# EasyEDA Pro project Usb_Hub.epro

# Schematic Schematic1
Board Name: Board1; Create Date: 2026-05-26; Page Name: P1; Project Name: Usb_Hub; Schematic Name: Schematic1; Update Date: 2026-05-27; Company: EasyEDA.com; Page Size: A4; Version: V1.0
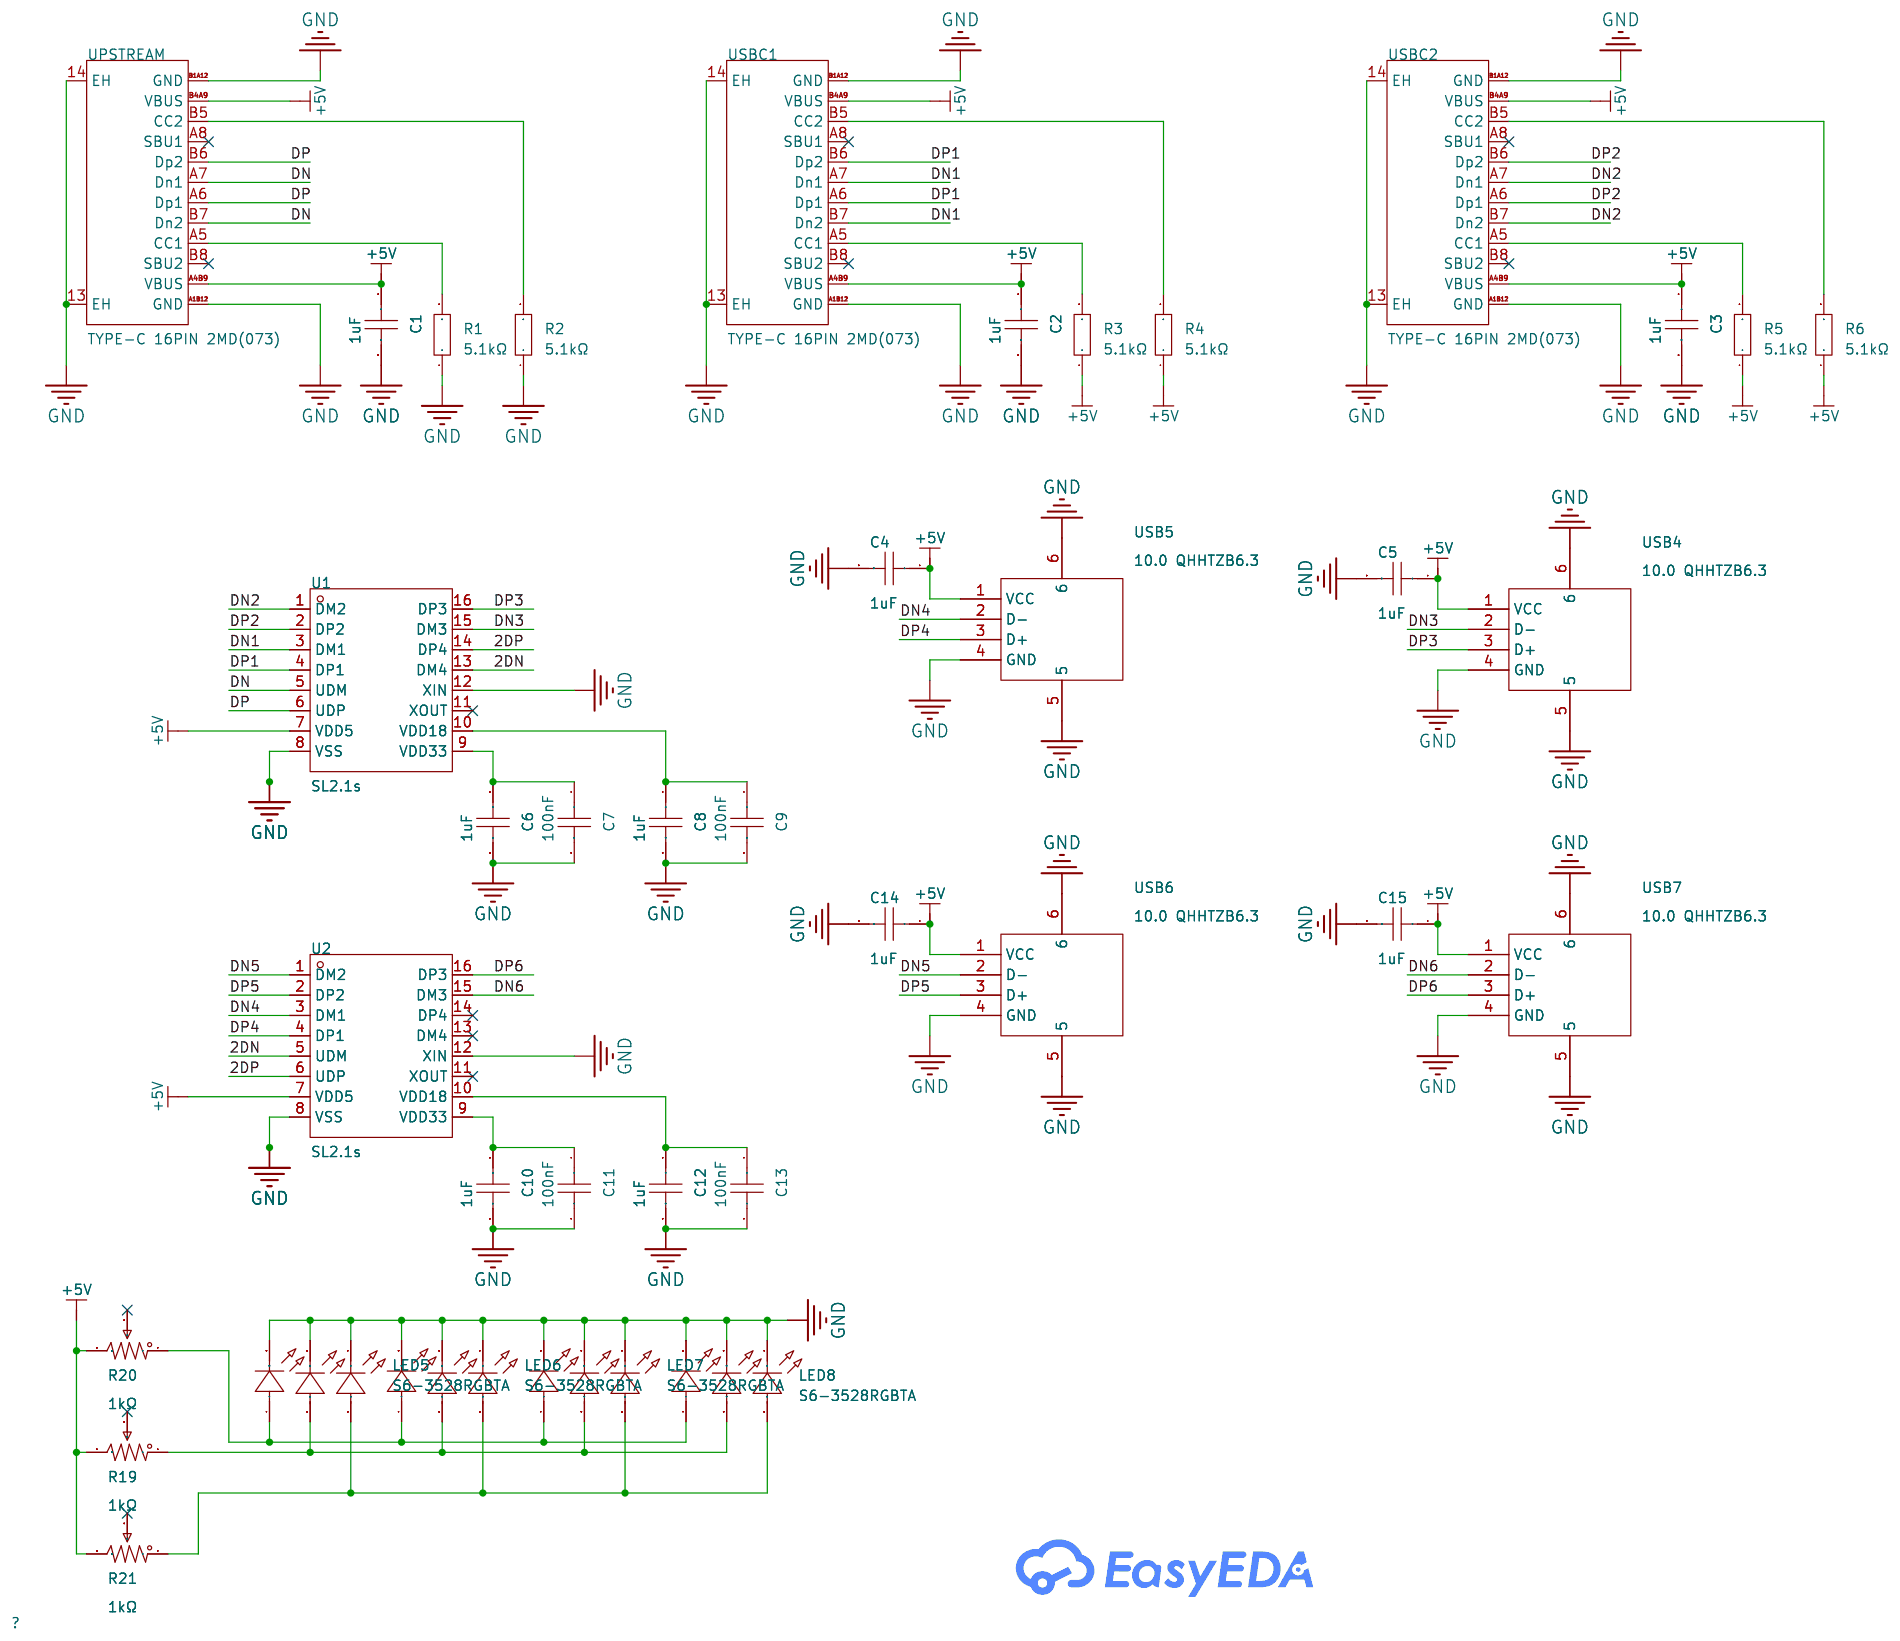
[diagram p0: schematic sheet]

## Parts
C1  1uF  [C0603]
C2  1uF  [C0603]
C3  1uF  [C0603]
C4  1uF  [C0603]
C5  1uF  [C0603]
C6  1uF  [C0603]
C7  100nF  [C0603]
C8  1uF  [C0603]
C9  100nF  [C0603]
C10  1uF  [C0603]
C11  100nF  [C0603]
C12  1uF  [C0603]
C13  100nF  [C0603]
C14  1uF  [C0603]
C15  1uF  [C0603]
LED5  S6-3528RGBTA  [LED-SMD-6P_S6-3528RGBTA]
LED6  S6-3528RGBTA  [LED-SMD-6P_S6-3528RGBTA]
LED7  S6-3528RGBTA  [LED-SMD-6P_S6-3528RGBTA]
LED8  S6-3528RGBTA  [LED-SMD-6P_S6-3528RGBTA]
R1  5.1kΩ  [R0603]
R2  5.1kΩ  [R0603]
R3  5.1kΩ  [R0603]
R4  5.1kΩ  [R0603]
R5  5.1kΩ  [R0603]
R6  5.1kΩ  [R0603]
R19  1kΩ  [RES-ADJ-SMD_3P-L3.8-W3.6-P1.90-BL]
R20  1kΩ  [RES-ADJ-SMD_3P-L3.8-W3.6-P1.90-BL]
R21  1kΩ  [RES-ADJ-SMD_3P-L3.8-W3.6-P1.90-BL]
U1  SL2.1s  [SSOP-16_L4.6-W2.6-P0.53-LS4.0-BL]
U2  SL2.1s  [SSOP-16_L4.6-W2.6-P0.53-LS4.0-BL]
UPSTREAM  TYPE-C 16PIN 2MD(073)  [USB-C-SMD_TYPE-C-16PIN-2MD-073]
USB4  10.0 QHHTZB6.3  [USB-A-TH_10.0QHHTZB6.3]
USB5  10.0 QHHTZB6.3  [USB-A-TH_10.0QHHTZB6.3]
USB6  10.0 QHHTZB6.3  [USB-A-TH_10.0QHHTZB6.3]
USB7  10.0 QHHTZB6.3  [USB-A-TH_10.0QHHTZB6.3]
USBC1  TYPE-C 16PIN 2MD(073)  [USB-C-SMD_TYPE-C-16PIN-2MD-073]
USBC2  TYPE-C 16PIN 2MD(073)  [USB-C-SMD_TYPE-C-16PIN-2MD-073]

## Library data of the parts
C1-C6 C8 C10 C12 C14 C15 = CL10A105KB8NNNC: Capacitance:1uF Tolerance:±10% Tolerance:±10% Voltage Rating:50V Temperature Coefficient:X5R; LCSC Part Name: 1uF ±10% 50V; Supplier Part: C15849; Manufacturer: SAMSUNG(三星); Supplier Footprint: 0603; JLCPCB Part Class: Basic Part; Datasheet: https://item.szlcsc.com/datasheet/CL10A105KB8NNNC/16531.html; Supplier: LCSC; Tolerance: ±10%; Voltage Rating: 50V; Temperature Coefficient: X5R
C7 C9 C11 C13 = C0603X104K050T: Capacitance: Tolerance:±10% Tolerance:±10% Voltage Rated: Temperature Coefficient:; LCSC Part Name: 100nF ±10% 50V; Supplier Part: C187860; Manufacturer: IHHEC(禾伸堂); Supplier Footprint: 0603; JLCPCB Part Class: Extended Part; Datasheet: https://atta.szlcsc.com/upload/public/pdf/source/20180316/B1A881EE882D7AA2911761F448C7BFE2.pdf; Supplier: LCSC; Tolerance: ±10%
LED5-LED8 = S6-3528RGBTA: Viewing Angle:120° Lens Color:Water Clear Operating Temperature:-40℃~+85℃ Operating Temperature:-40℃~+85℃; LCSC Part Name: RGB三色; Supplier Part: C2843672; Manufacturer: TUOZHAN(拓展光电); Supplier Footprint: SMD3528-6P; JLCPCB Part Class: Extended Part; Datasheet: https://item.szlcsc.com/datasheet/S6-3528RGBTA/3032464.html; Supplier: LCSC; Viewing Angle: 120°; Lens Color: Water Clear; Operating Temperature: -40℃~+85℃
R1-R6 = 0603WAF5101T5E: Type:Thick Film Resistor Resistance:5.1kΩ Tolerance:±1% Tolerance:±1% Power(Watts):100mW Voltage-Supply(Max):75V Temperature Coefficient:±100ppm/℃ Temperature Coefficient:±100ppm/℃ Operating Temperature:-55℃~+155℃ Operating Temperature:-55℃~+155℃; LCSC Part Name: 5.1kΩ ±1% 100mW 厚膜电阻; Supplier Part: C23186; Manufacturer: UNI-ROYAL(厚声); Supplier Footprint: 0603; JLCPCB Part Class: Basic Part; Datasheet: https://item.szlcsc.com/datasheet/0603WAF5101T5E/23913.html; Supplier: LCSC; Type: Thick Film Resistor; Tolerance: ±1%; Power(Watts): 100mW; Voltage-Supply(Max): 75V; Temperature Coefficient: ±100ppm/℃; Operating Temperature: -55℃~+155℃
R19-R21 = TC33X-2-102E: Resistance:1kΩ Tolerance:±25% Tolerance:±25% Voltage Rating:- Power(Watts):150mW Temperature Coefficient:±250ppm/℃ Temperature Coefficient:±250ppm/℃ Number of Turns:; LCSC Part Name: 1kΩ ±25%; Supplier Part: C719174; Manufacturer: BOURNS; Supplier Footprint: SMD-3P,3.8x3.6mm; JLCPCB Part Class: Extended Part; Datasheet: https://item.szlcsc.com/datasheet/TC33X-2-102E/762156.html; Supplier: LCSC; Tolerance: ±25%; Power(Watts): 150mW; Temperature Coefficient: ±250ppm/℃
U1 U2 = SL2.1s: type:Hub USB Protocol:USB 2.0 Data Rate:- Voltage - Supply:4V~5.25V Voltage - Supply:4V~5.25V Operating Temperature:0℃~+70℃ Operating Temperature:0℃~+70℃ Memory Interface:- Current - Supply:120mA Quiescent Supply Current:2.5mA Number of Channels:4; LCSC Part Name: USB2.0 HUB控制器集成电路; Supplier Part: C2684433; Manufacturer: CoreChips(和芯润德); Supplier Footprint: SSOP-16; JLCPCB Part Class: Extended Part; Datasheet: https://item.szlcsc.com/datasheet/SL2.1s/2782346.html; Supplier: LCSC; type: Hub; USB Protocol: USB 2.0; Voltage - Supply: 4V~5.25V; Operating Temperature: 0℃~+70℃; Current - Supply: 120mA; Quiescent Supply Current: 2.5mA; Number of Channels: 4
UPSTREAM USBC1 USBC2 = TYPE-C 16PIN 2MD(073): Connector Type:Type-C Protocol Standard:- Gender:Female Mounting Type:Surface Mount, Right Angle Number of Contacts:16P Number of Ports:1 Current Rating-Power:3A Voltage Rating:5V Connect-Disconnect Life:10,000 Cycles Supplementary Features:- Center Heigh; LCSC Part Name: Type-C 母 卧贴; Supplier Part: C2765186; Manufacturer: SHOU HAN(首韩); Supplier Footprint: SMD; JLCPCB Part Class: Extended Part; Datasheet: https://item.szlcsc.com/datasheet/TYPE-C%252016PIN%25202MD(073)/2901843.html; Supplier: LCSC; Connector Type: Type-C; Gender: Female; Mounting Type: Surface Mount, Right Angle; Number of Contacts: 16P; Number of Ports: 1; Current Rating-Power: 3A; Voltage Rating: 5V; Connect-Disconnect Life: 10,000 Cycles; Detection color: Black; Operating Temperature: -25℃~+85℃
USB4-USB7 = 10.0 QHHTZB6.3: Connector Type:Type-A Protocol Standard:USB 2.0 Gender:Female Mounting Type:Surface Mount, Right Angle Number of Contacts:4P Number of Ports:1 Current Rating-Power:1.5A Voltage Rating:30V Connect-Disconnect Life:5,000 times Supplementary Features:- Center; LCSC Part Name: 壳长10.0mm; Supplier Part: C668591; Manufacturer: SHOU HAN(首韩); Supplier Footprint: SMD; JLCPCB Part Class: Extended Part; Datasheet: https://item.szlcsc.com/datasheet/10.0%2520QHHTZB6.3/698534.html; Supplier: LCSC; Connector Type: Type-A; Protocol Standard: USB 2.0; Gender: Female; Mounting Type: Surface Mount, Right Angle; Number of Contacts: 4P; Number of Ports: 1; Current Rating-Power: 1.5A; Voltage Rating: 30V; Connect-Disconnect Life: 5,000 times; Length: 10mm; Detection color: Black; Operating Temperature: -25℃~+85℃

## Nets
+5V: C1.1 C2.1 C3.1 C4.1 C5.1 C14.1 C15.1 R3.1 R4.1 R5.1 R6.1 R19.3 R20.3 R21.3 U1.7(VDD5) U2.7(VDD5) UPSTREAM.A4B9(VBUS) UPSTREAM.B4A9(VBUS) USB4.1(VCC) USB5.1(VCC) USB6.1(VCC) USB7.1(VCC) USBC1.A4B9(VBUS) USBC1.B4A9(VBUS) USBC2.A4B9(VBUS) USBC2.B4A9(VBUS)
GND: C1.2 C2.2 C3.2 C4.2 C5.2 C6.2 C7.2 C8.2 C9.2 C10.2 C11.2 C12.2 C13.2 C14.2 C15.2 LED5.1 LED5.2 LED5.3 LED6.1 LED6.2 LED6.3 LED7.1 LED7.2 LED7.3 LED8.1 LED8.2 LED8.3 R1.1 R2.1 U1.8(VSS) U1.12(XIN) U2.8(VSS) U2.12(XIN) UPSTREAM.13(EH) UPSTREAM.14(EH) UPSTREAM.A1B12(GND) UPSTREAM.B1A12(GND) USB4.4(GND) USB4.5 USB4.6 USB5.4(GND) USB5.5 USB5.6 USB6.4(GND) USB6.5 USB6.6 USB7.4(GND) USB7.5 USB7.6 USBC1.13(EH) USBC1.14(EH) USBC1.A1B12(GND) USBC1.B1A12(GND) USBC2.13(EH) USBC2.14(EH) USBC2.A1B12(GND) USBC2.B1A12(GND)
2DN: U1.13(DM4) U2.5(UDM)
2DP: U1.14(DP4) U2.6(UDP)
DN: U1.5(UDM) UPSTREAM.A7(Dn1) UPSTREAM.B7(Dn2)
DN1: U1.3(DM1) USBC1.A7(Dn1) USBC1.B7(Dn2)
DN2: U1.1(DM2) USBC2.A7(Dn1) USBC2.B7(Dn2)
DN3: U1.15(DM3) USB4.2(D-)
DN4: U2.3(DM1) USB5.2(D-)
DN5: U2.1(DM2) USB6.2(D-)
DN6: U2.15(DM3) USB7.2(D-)
DP: U1.6(UDP) UPSTREAM.A6(Dp1) UPSTREAM.B6(Dp2)
DP1: U1.4(DP1) USBC1.A6(Dp1) USBC1.B6(Dp2)
DP2: U1.2(DP2) USBC2.A6(Dp1) USBC2.B6(Dp2)
DP3: U1.16(DP3) USB4.3(D+)
DP4: U2.4(DP1) USB5.3(D+)
DP5: U2.2(DP2) USB6.3(D+)
DP6: U2.16(DP3) USB7.3(D+)
$1N1306: R1.2 UPSTREAM.A5(CC1)
$1N1314: R2.2 UPSTREAM.B5(CC2)
$1N1689: R4.2 USBC1.B5(CC2)
$1N1692: R3.2 USBC1.A5(CC1)
$1N1910: R6.2 USBC2.B5(CC2)
$1N1913: R5.2 USBC2.A5(CC1)
$1N2720: C6.1 C7.1 U1.9(VDD33)
$1N2798: C8.1 C9.1 U1.10(VDD18)
$1N3096: C10.1 C11.1 U2.9(VDD33)
$1N3102: C12.1 C13.1 U2.10(VDD18)
$1N5396: LED5.5 LED6.5 LED7.5 LED8.5 R19.1
$1N5400: LED5.4 LED6.4 LED7.4 LED8.4 R20.1
$1N5407: LED5.6 LED6.6 LED7.6 LED8.6 R21.1

Not connected (* = marked no-connect by the designer): R19 2*; R20 2*; R21 2*; U1 11(XOUT)*; U2 11(XOUT)* 13(DM4)* 14(DP4)*; UPSTREAM A8(SBU1)* B8(SBU2)*; USBC1 A8(SBU1)* B8(SBU2)*; USBC2 A8(SBU1)* B8(SBU2)*

# Board PCB1
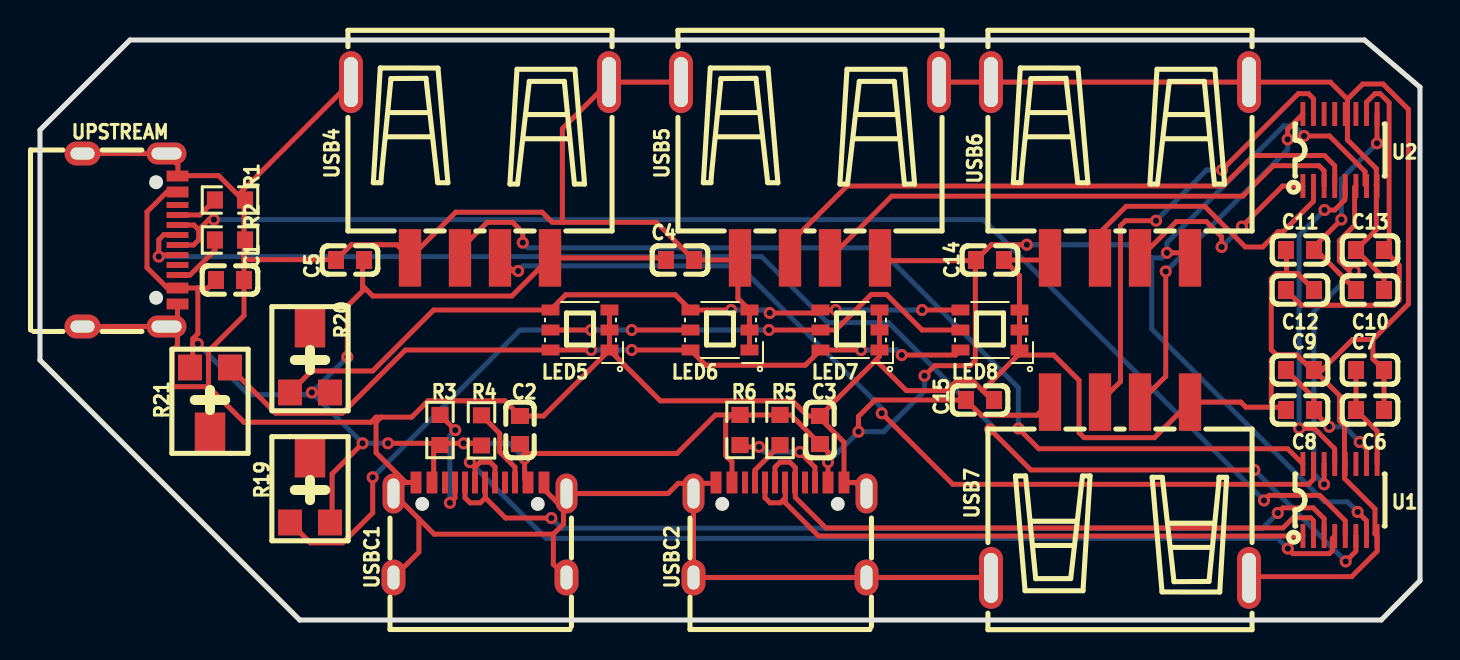
[diagram p1: board, top side]
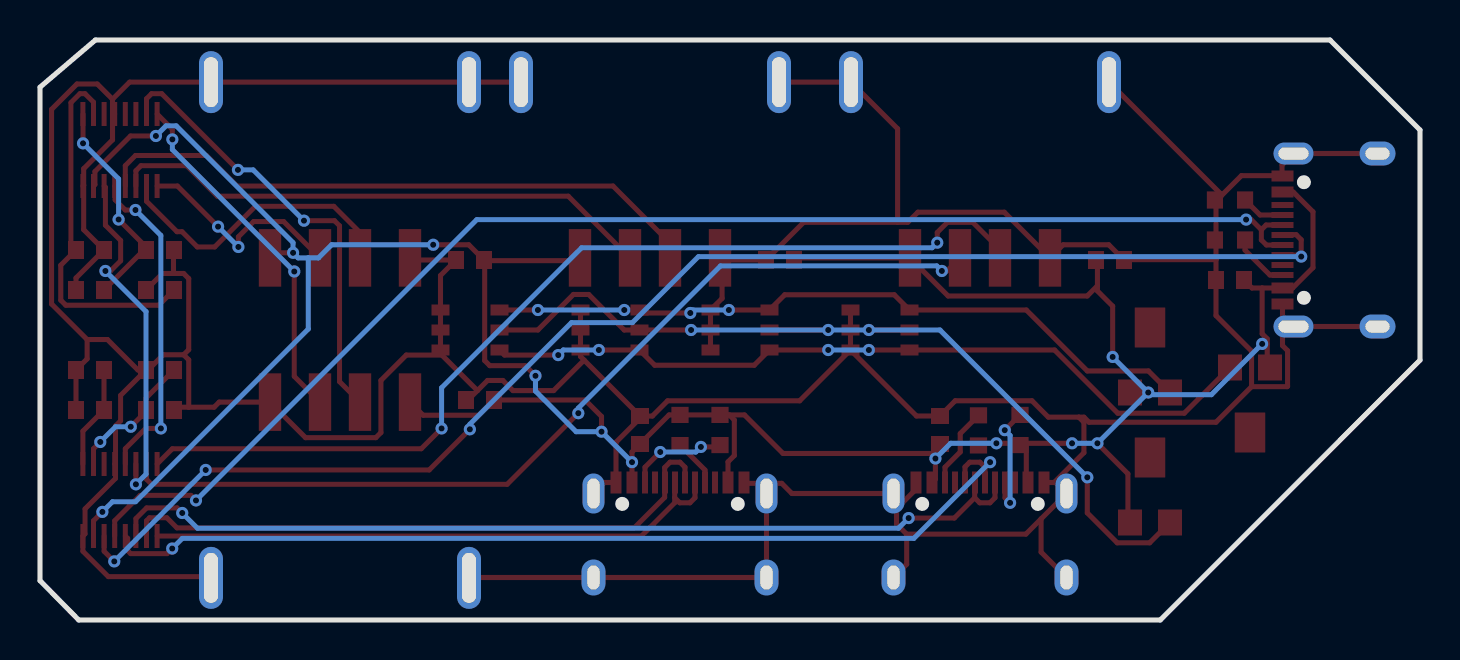
[diagram p2: board, bottom side, seen from below]

Outline 69 x 29 mm; copper layers: Top Layer, Bottom Layer. Coordinates in mm from the lower left corner of the outline.
Outline path: 0,24.5 0,12.99 12.98,0 67.06,0 69,1.97 69,26.64 66.23,29 4.5,29 0,24.5
Stack: Top Layer 0.035mm / Dielectric1 1.51mm FR4 er 4.5 / Bottom Layer 0.035mm

## Design rules (mm)
template: JLCPCB Capability(Two Layers Board)
spacing copperThickness1oz (default): track to track 0.102, other pairs 0.152 to 0.3
spacing copperThickness2oz: track to track 0.203, other pairs 0.152 to 0.3
track width copperThickness1oz (default): min 0.127, default 0.254, max 2.54
track width copperThickness2oz: min 0.203, default 0.254, max 2.54
differential pair differentialPair (default): width min 0.127, default 0.254, max 2.54; gap min 0.152, default 0.152
via viaSize (default): diameter min 0.5, default 0.61, max 10; hole min 0.3, default 0.305, max 6.3

## Placement (name value [footprint] x y rotation side)
C1  1uF  [C0603]  9.5 17 0 top
C2  1uF  [C0603]  24 9.5 90 top
C3  1uF  [C0603]  39 9.5 90 top
C4  1uF  [C0603]  32 18 0 top
C5  1uF  [C0603]  15.5 18 180 top
C6  1uF  [C0603]  66.5 10.5 0 top
C7  100nF  [C0603]  66.5 12.5 0 top
C8  1uF  [C0603]  63 10.5 180 top
C9  100nF  [C0603]  63 12.5 0 top
C10  1uF  [C0603]  66.5 16.5 0 top
C11  100nF  [C0603]  63 18.5 180 top
C12  1uF  [C0603]  63 16.5 0 top
C13  100nF  [C0603]  66.5 18.5 180 top
C14  1uF  [C0603]  47.5 18 0 top
C15  1uF  [C0603]  47 11 0 top
LED5  S6-3528RGBTA  [LED-SMD-6P_S6-3528RGBTA]  27 14.5 90 top
LED6  S6-3528RGBTA  [LED-SMD-6P_S6-3528RGBTA]  34 14.5 90 top
LED7  S6-3528RGBTA  [LED-SMD-6P_S6-3528RGBTA]  40.5 14.5 90 top
LED8  S6-3528RGBTA  [LED-SMD-6P_S6-3528RGBTA]  47.5 14.5 90 top
R1  5.1kΩ  [R0603]  9.5 21 180 top
R2  5.1kΩ  [R0603]  9.5 19 180 top
R3  5.1kΩ  [R0603]  20 9.5 90 top
R4  5.1kΩ  [R0603]  22.08 9.48 90 top
R5  5.1kΩ  [R0603]  37 9.5 270 top
R6  5.1kΩ  [R0603]  35 9.5 270 top
R19  1kΩ  [RES-ADJ-SMD_3P-L3.8-W3.6-P1.90-BL]  13.5 6.5 270 top
R20  1kΩ  [RES-ADJ-SMD_3P-L3.8-W3.6-P1.90-BL]  13.5 13 270 top
R21  1kΩ  [RES-ADJ-SMD_3P-L3.8-W3.6-P1.90-BL]  8.5 11 90 top
U1  SL2.1s  [SSOP-16_L4.6-W2.6-P0.53-LS4.0-BL]  65 6 0 top
U2  SL2.1s  [SSOP-16_L4.6-W2.6-P0.53-LS4.0-BL]  65 23.5 0 top
UPSTREAM  TYPE-C 16PIN 2MD(073)  [USB-C-SMD_TYPE-C-16PIN-2MD-073]  4.5 19 270 top
USB4  10.0 QHHTZB6.3  [USB-A-TH_10.0QHHTZB6.3]  22 22.5 180 top
USB5  10.0 QHHTZB6.3  [USB-A-TH_10.0QHHTZB6.3]  38.5 22.5 180 top
USB6  10.0 QHHTZB6.3  [USB-A-TH_10.0QHHTZB6.3]  54 22.5 180 top
USB7  10.0 QHHTZB6.3  [USB-A-TH_10.0QHHTZB6.3]  54 6.5 0 top
USBC1  TYPE-C 16PIN 2MD(073)  [USB-C-SMD_TYPE-C-16PIN-2MD-073]  22 4.5 0 top
USBC2  TYPE-C 16PIN 2MD(073)  [USB-C-SMD_TYPE-C-16PIN-2MD-073]  37 4.5 0 top

## Footprints (pads in the part's own frame, mm; a bottom-side part is the same pattern mirrored in y, then rotated)
C0603
  rect 0.8x0.9 smd: 1(-0.7,0) 2(0.7,0)
LED-SMD-6P_S6-3528RGBTA
  rect 0.55x0.9 smd: 1(-1,-1.475) 2(0,-1.475) 3(1,-1.475) 4(1,1.475) 5(0,1.475) 6(-1,1.475)
R0603
  rect 0.806x0.864 smd: 1(-0.753,0) 2(0.753,0)
RES-ADJ-SMD_3P-L3.8-W3.6-P1.90-BL
  rect 1.3x1.2 smd: 1(1.625,-1) 3(1.625,1)
  rect 2x1.524 smd: 2(-1.625,0)
SSOP-16_L4.6-W2.6-P0.53-LS4.0-BL
  rect 0.25x1.2 smd: 1(-1.855,-1.8) 2(-1.325,-1.8) 3(-0.795,-1.8) 4(-0.265,-1.8) 5(0.265,-1.8) 6(0.795,-1.8) 7(1.325,-1.8) 8(1.855,-1.8) 9(1.855,1.8) 10(1.325,1.8) 11(0.795,1.8) 12(0.265,1.8) 13(-0.265,1.8) 14(-0.795,1.8) 15(-1.325,1.8) 16(-1.855,1.8)
USB-A-TH_10.0QHHTZB6.3
  rect 1.12x2.88 smd: 1(-3.5,4.395) 2(-1,4.395) 3(1,4.395) 4(3.5,4.395)
  oval 1.2x3.1 hole 0.7x2.5: 5(-6.45,-4.395) 6(6.45,-4.395)
USB-C-SMD_TYPE-C-16PIN-2MD-073
  oval 1.1x2 hole 0.6x1.5: 13(-4.325,1.825) 14(4.325,1.825)
  oval 1.2x1.8 hole 0.6x1.2: 13(-4.325,-2.375) 14(4.325,-2.375)
  rect 0.55x1.1 smd: A1B12(-3.2,2.375) A4B9(-2.4,2.375) B1A12(3.2,2.375) B4A9(2.4,2.375)
  rect 0.3x1.1 smd: A5(-1.25,2.375) A6(-0.25,2.375) A7(0.25,2.375) A8(1.25,2.375) B5(1.75,2.375) B6(0.75,2.375) B7(-0.75,2.375) B8(-1.75,2.375)

## Nets
As in the schematic.

Pads without a net: R19 2; R20 2; R21 2; U1 11; U2 11 13 14; UPSTREAM A8 B8; USBC1 A8 B8; USBC2 A8 B8

## Via types
v1: diameter 0.61, hole 0.305, Top Layer to Bottom Layer, 58 vias

## Routing (per net, layer and track width the routed paths; a pad name or vN(x,y) marks a point on that pad's centre or on a via; arc(x,y) is an arc through that point)
+5V: length 164.6
  Top Layer w0.25: v1(65.88,5.41) 66.32,4.96 U1.7 ; v1(63.21,24.2) 64.47,24.2 66.25,22.42 66.25,21.77 U2.7
  Top Layer w0.254: 19.69,8.83 19.91,8.83 ; 19.69,8.83 19.69,6.96 USBC1.A4B9 ; 19.69,8.83 v1(17.4,8.83) ; 19.91,8.83 R3.1 ; 19.91,8.83 v1(21.18,8.83) 21.97,8.83 R4.1 ; 46.77,17.97 42.14,17.97 USB5.1 ; 46.77,17.97 C14.1 47.56,18.76 v1(49.34,18.76) ; 46.77,17.97 46.77,12.97 46.51,12.72 44.73,12.72 v1(44.23,12.21) ; UPSTREAM.A4B9 6.34,21.4 5.35,20.41 5.35,17.62 6.37,16.6 UPSTREAM.B4A9 7.89,16.6 ; 24.23,8.33 31.85,8.33 33.78,10.25 34.54,10.25 ; 24.23,8.33 v1(24.23,8.07) 24.23,7.05 USBC1.B4A9 ; 24.23,8.33 24.23,8.57 C2.1 ; 7.64,13.81 7.64,14.06 7.89,14.31 7.89,16.6 ; 7.64,13.81 v1(7.89,13.81) ; 7.64,13.81 7.64,12.76 R21.3 ; USBC2.A4B9 34.6,7.91 34.28,8.22 34.28,10 34.54,10.25 ; v1(13.59,11.38) R20.3 ; 34.54,10.25 R6.1 R5.1 37.55,10.25 C3.1 39.4,8.4 v1(39.4,7.89) USBC2.B4A9 ; 7.89,16.6 8.4,16.6 C1.1 ; 16.13,16.71 16.13,16.45 15.37,15.69 v1(15.37,13.15) ; 16.13,16.71 16.64,16.2 23.6,16.2 USB4.1 31.19,18.11 C4.1 ; 16.13,16.71 16.13,17.93 C5.1 ; v1(40.92,9.42) 40.92,10.18 41.75,11 C15.1 47.06,10.24 49.84,10.24 USB7.1 ; USB6.1 57.25,18.36 v1(56.35,18.36) ; R19.3 14.61,4.98 14.61,7.31 v1(16.13,8.83)
  Bottom Layer w0.25: v1(63.21,24.2) 62.7,24.71 62.19,24.71 56.35,18.87 v1(56.35,18.36) ; v1(65.88,5.41) 65.37,5.91 64.22,5.91 55.59,14.55 55.59,18.11
  Bottom Layer w0.254: v1(17.4,8.83) v1(16.13,8.83) v1(13.59,11.38) ; v1(56.35,18.36) 56.09,18.11 55.08,18.11 54.42,18.76 v1(49.34,18.76) ; v1(39.4,7.89) v1(40.92,9.42) 42.19,9.42 44.23,11.45 v1(44.23,12.21) ; v1(13.59,11.38) 13.48,11.27 10.43,11.27 v1(7.89,13.81) ; v1(13.59,11.38) v1(15.37,13.15) ; v1(21.18,8.83) 23.47,8.83 v1(24.23,8.07)
GND: length 302.1
  Top Layer w0.25: 65.37,25.28 U2.12 ; 65.37,26.04 64.52,26.89 USB6.5 ; 65.22,7.84 65.22,7.08 66.75,5.56 66.75,4.31 U1.8 66.85,3.44 65.59,2.17 60.51,2.17 USB7.6 ; 65.22,7.84 65.22,9.71 64.97,9.96 64.97,11.23 C9.2 ; 65.22,7.84 U1.12 ; 66.82,21.74 U2.8
  Top Layer w0.254: USB5.5 USB6.6 USB6.5 ; 61.82,13.26 62.83,13.26 63.6,12.5 C9.2 64.1,12.5 65.63,14.02 66.64,14.02 ; 61.82,13.26 61.56,13.01 61.56,10.64 ; 61.82,13.26 61.56,13.52 61.56,17.07 61.82,17.33 62.33,17.33 ; LED5.1 31.01,10.96 37.62,10.96 38.38,10.2 38.89,10.2 ; LED5.1 25.18,10.2 C2.2 23.24,10.96 19.4,10.96 18.58,10.14 17.06,10.14 ; LED5.1 LED5.2 LED5.3 ; USBC1.13 18.94,3.39 18.94,5.06 ; 25.92,5.82 25.92,5.92 USBC1.14 31.41,6.33 31.91,6.83 32.68,6.83 ; 25.92,5.82 26.17,5.56 26.17,4.8 25.67,4.29 ; 25.92,5.82 25.2,6.54 USBC1.B1A12 ; 62.33,17.33 62.33,18.47 C11.2 ; 62.33,17.33 62.87,17.33 C12.2 ; 47.13,11.47 46.62,11.98 45.86,11.98 45.35,11.47 43.32,11.47 41.79,12.99 ; 47.13,11.47 47.6,11 C15.2 ; 47.13,11.47 48.91,13.25 ; 8.42,11.67 8.42,13.44 10.2,15.22 C1.2 10.2,18.02 ; 8.42,11.67 6.64,11.67 6.62,11.69 6.62,13.47 6.88,13.72 6.88,14.74 ; 8.42,11.67 10.2,9.89 16.55,9.89 16.8,10.14 17.06,10.14 ; 18.29,6.88 USBC1.A1B12 ; 18.29,6.88 16.8,8.36 16.8,9.89 17.06,10.14 ; 18.29,6.88 18.22,6.88 USBC1.13 18.94,5.06 ; 61.56,10.64 62.16,10.64 C8.2 ; 61.56,10.64 60.29,10.64 60.04,10.89 USB7.4 55.72,9.12 52.21,9.12 51.95,9.37 51.95,11.98 50.68,13.25 48.91,13.25 ; 48.91,13.25 48.91,13.43 LED8.1 LED8.2 LED8.3 48.97,17.22 C14.2 50.4,18 USB6.4 ; 6.88,14.74 UPSTREAM.B1A12 ; 6.88,14.74 6.39,14.74 UPSTREAM.14 UPSTREAM.14 ; 10.2,18.02 14.78,18.02 C5.2 15.56,18.76 17.84,18.76 USB4.4 20.79,20.39 25.1,20.39 25.61,19.88 26.12,19.88 ; 10.2,18.02 10.2,18.95 ; 10.2,18.95 R2.1 ; 10.2,18.95 10.2,20.95 ; 18.94,5.06 19.71,4.29 25.67,4.29 ; USBC2.A1B12 33.76,6.83 32.68,6.83 ; 6.9,22.22 8.93,22.22 9.95,21.2 ; 6.9,22.22 UPSTREAM.A1B12 ; 6.9,22.22 6.9,22.75 UPSTREAM.13 UPSTREAM.13 ; 66.64,14.02 66.64,13.06 C7.2 C6.2 ; 66.64,14.02 68.42,15.8 68.42,25.53 67.15,26.8 66.14,26.8 65.37,26.04 65.37,24.01 66.82,22.56 66.82,19.52 C13.2 67.2,17.1 C10.2 ; USBC1.14 25.67,2.78 25.67,4.29 ; 10.2,20.95 R1.1 ; 10.2,20.95 9.95,21.2 ; 38.89,10.2 C3.2 41.79,12.99 ; 38.89,10.2 40.2,8.89 USBC2.B1A12 40.78,6.88 USBC2.14 ; USB5.6 USB4.5 26.12,24.56 26.12,19.88 ; 32.68,6.83 USBC2.13 USBC2.13 USBC2.14 47.53,2.12 USB7.5 ; 41.79,12.99 41.97,13.17 LED7.1 LED7.2 LED7.3 ; LED6.1 LED6.2 LED6.3 34.9,16.08 34.9,18 ; USB4.6 9.95,21.29 9.95,21.2 ; 26.12,19.88 30.82,19.88 C4.2 34.9,18 ; 34.9,18 USB5.4
2DN: length 16.3
  Top Layer w0.25: U2.5 65.24,21.68 65.24,21.01 64.74,20.5 v1(64.23,20.5) ; U1.13 64.74,8.56 63.72,9.58 v1(62.96,9.58)
  Bottom Layer w0.25: v1(62.96,9.58) 62.96,19.23 v1(64.23,20.5)
2DP: length 17.8
  Top Layer w0.25: v1(65.73,17.45) 65.47,17.45 64.97,17.96 64.97,18.98 65.73,19.74 65.73,21.63 U2.6 ; U1.14 v1(64.21,6.78)
  Bottom Layer w0.25: v1(65.73,17.45) 63.7,15.42 63.7,7.29 v1(64.21,6.78)
DN: length 67.6
  Top Layer w0.25: UPSTREAM.A7 7.68,18.75 7.93,19 7.93,19.51 8.44,20.02 v1(8.69,20.02) ; v1(61.2,5.98) 61.46,6.23 64,6.23 65.26,4.96 U1.5
  Top Layer w0.254: 7.93,19.51 7.69,19.75 UPSTREAM.B7
  Bottom Layer w0.25: v1(61.2,5.98) 47.16,20.02 v1(8.69,20.02)
DN1: length 46.8
  Top Layer w0.25: 22.27,6.11 23.28,5.1 v1(25.57,5.1) ; U1.3 64.21,5.07 63.67,5.61 62.14,5.61 v1(61.89,5.35)
  Top Layer w0.254: USBC1.B7 21.25,6.11 21.5,5.86 22.01,5.86 22.27,6.11 22.27,6.86 USBC1.A7
  Bottom Layer w0.25: v1(61.89,5.35) 61.13,4.59 26.08,4.59 v1(25.57,5.1)
DN2: length 29.6
  Top Layer w0.25: U1.1 38.93,4.2 37.27,5.86 37.27,6.11
  Top Layer w0.254: USBC2.B7 36.25,6.11 36.5,5.86 37.01,5.86 37.27,6.11 37.27,6.86 USBC2.A7
DN3: length 46.6
  Top Layer w0.25: U1.15 63.68,7.04 63.42,6.78 45.64,6.78 v1(42.09,10.34) ; v1(23.91,17.45) 23.65,17.45 USB4.2
  Bottom Layer w0.25: v1(42.09,10.34) 42.09,10.59 34.97,17.71 24.16,17.71 v1(23.91,17.45)
DN4: length 27.5
  Top Layer w0.25: USB5.2 42.59,21.19 60.14,21.19 61.66,22.72 63.95,22.72 64.21,22.46 U2.3
DN5: length 11
  Top Layer w0.25: v1(60.1,19.67) 62.13,21.7 U2.1 ; USB6.2 56.82,19.92 58.32,19.92 59.08,19.16 v1(59.08,18.65)
  Bottom Layer w0.25: v1(60.1,19.67) v1(59.08,18.65)
DN6: length 22.5
  Top Layer w0.25: v1(55.8,19.97) 54.28,19.97 54.02,19.71 54.02,11.92 USB7.2 ; v1(59.1,22.51) 62.91,26.32 63.42,26.32 63.68,26.06 U2.15
  Bottom Layer w0.25: v1(55.8,19.97) 58.34,22.51 v1(59.1,22.51)
DP: length 70.1
  Top Layer w0.25: v1(60.72,7.5) 49.54,7.5 v1(47.51,9.53) ; U1.6 65.79,3.44 v1(65.29,2.93) ; UPSTREAM.B6 5.94,18.25 v1(5.94,18.17)
  Top Layer w0.254: UPSTREAM.A6 6.86,19.27 6.19,19.27 5.94,19.01 5.94,18.25
  Bottom Layer w0.25: v1(47.51,9.53) 47.51,9.79 42.43,14.87 39.38,14.87 36.08,18.17 v1(5.94,18.17) ; v1(65.29,2.93) v1(60.72,7.5)
DP1: length 49
  Top Layer w0.25: v1(62.39,3.57) 62.64,3.32 64.47,3.32 64.62,3.47 64.62,4.08 U1.4 ; 21.75,7.64 v1(21.5,7.89)
  Top Layer w0.254: USBC1.B6 22.75,7.65 22.51,7.89 22,7.89 21.75,7.64 USBC1.A6
  Bottom Layer w0.25: v1(62.39,3.57) 61.88,4.08 25.31,4.08 v1(21.5,7.89)
DP2: length 31.1
  Top Layer w0.25: 37.77,6.89 37.77,6.13 39.29,4.61 62.15,4.61 62.66,5.11 63.52,5.11 63.68,4.96 U1.2
  Top Layer w0.254: USBC2.A6 36.75,7.64 37,7.89 37.5,7.89 37.77,7.62 37.77,6.89 USBC2.B6
DP3: length 49.6
  Top Layer w0.25: USB4.3 21.09,18.19 21.09,18.61 22.36,19.88 23.63,19.88 24.14,19.38 v1(24.14,18.87) ; U1.16 62.38,8.56 49.94,8.56 v1(48.92,9.58)
  Bottom Layer w0.25: v1(24.14,18.87) 24.39,18.61 41.92,18.61 48.92,11.61 v1(48.92,9.58)
DP4: length 31
  Top Layer w0.25: U2.4 64.74,22.72 64.23,23.22 60.67,23.22 59.15,21.7 40.35,21.7 37.56,18.91 37.56,18.16 USB5.3
DP5: length 15
  Top Layer w0.25: U2.2 63.68,20.94 62.15,19.41 61.9,19.41 61.13,18.65 60.27,18.65 58.23,20.68 54.31,20.68 53.04,19.41 53.04,18.14 USB6.3
DP6: length 17.8
  Top Layer w0.25: v1(62.38,24.03) 62.38,24.54 U2.16 ; v1(56.29,17.43) 56.29,12.18 USB7.3
  Bottom Layer w0.25: v1(62.38,24.03) 62.38,23.52 v1(56.29,17.43)
$1N1306: length 2.2
  Top Layer w0.254: R1.2 8,20.25 UPSTREAM.A5
$1N1314: length 2.9
  Top Layer w0.254: R2.2 8.75,18.49 7.5,17.25 UPSTREAM.B5
$1N1689: length 4.1
  Top Layer w0.254: R4.2 22.99,9.32 22.99,8.4 23.75,7.64 USBC1.B5
$1N1692: length 5.9
  Top Layer w0.254: USBC1.A5 20.75,6.11 v1(20.5,5.86) ; v1(20.76,9.49) R3.2
  Bottom Layer w0.254: v1(20.76,9.49) 20.5,9.23 v1(20.5,5.86)
$1N1910: length 5
  Top Layer w0.254: v1(35.96,8.65) 35.09,8.65 R6.2 ; v1(37.99,8.4) 38.75,7.64 USBC2.B5
  Bottom Layer w0.254: v1(35.96,8.65) 36.21,8.4 v1(37.99,8.4)
$1N1913: length 2.4
  Top Layer w0.254: R5.2 35.75,7.5 USBC2.A5
$1N2720: length 5.1
  Top Layer w0.25: U1.9 66.85,9.44 C6.1
  Top Layer w0.254: C6.1 C7.1
$1N2798: length 6.8
  Top Layer w0.25: v1(64.46,9.66) 63.7,10.42 C8.1 ; U1.10 66.32,8.56 v1(65.99,8.9)
  Top Layer w0.254: C9.1 63.7,11.1 C8.1
  Bottom Layer w0.25: v1(64.46,9.66) 65.22,9.66 v1(65.99,8.9)
$1N3096: length 11
  Top Layer w0.25: v1(65.07,20.02) 63.8,18.75 63.8,18.5 ; v1(66.85,23.83) 66.85,25.29
  Top Layer w0.254: C10.1 63.8,18.5 C11.1
  Bottom Layer w0.25: v1(65.07,20.02) 65.07,22.06 v1(66.85,23.83)
$1N3102: length 18.5
  Top Layer w0.25: U2.10 66.32,25.89 66.75,26.32 67,26.32 67.45,25.87 67.45,18.75 C13.1
  Top Layer w0.254: C12.1 63.06,15.74 67.71,15.74 67.96,15.99 67.96,17.74 C13.1
$1N5396: length 45.8
  Top Layer w0.254: LED8.5 44.1,14.5 42.33,16.28 41.56,16.28 39.79,14.5 LED7.5 v1(36.45,14.5) ; R19.1 13.52,3.86 15.14,3.86 16.64,5.36 v1(16.64,7.13) ; LED5.5 v1(27.56,14.5) ; v1(29.59,14.5) LED6.5
  Bottom Layer w0.254: v1(36.45,14.5) v1(29.59,14.5) v1(27.56,14.5) 24,14.5 v1(16.64,7.13)
$1N5400: length 36
  Top Layer w0.254: v1(36.49,15.35) 38.88,15.35 LED7.4 v1(39.79,15.5) ; v1(44.1,15.5) LED8.4 ; v1(34.56,15.5) LED6.4 31.76,16.26 26.29,16.26 LED5.4 19.68,15.5 16.64,12.45 13.58,12.45 R20.1
  Bottom Layer w0.254: v1(34.56,15.5) 36.34,15.5 v1(36.49,15.35) ; v1(39.79,15.5) v1(44.1,15.5)
$1N5407: length 39.6
  Top Layer w0.254: R21.1 11.79,10.34 15.11,10.34 18.27,13.5 LED5.6 v1(27.56,13.5) ; v1(41.06,13.5) LED7.6 38.26,12.74 33.29,12.74 LED6.6 v1(29.59,13.5) ; LED8.6 45.77,13.25 v1(43.09,13.25)
  Bottom Layer w0.254: v1(27.56,13.5) v1(29.59,13.5) ; v1(43.09,13.25) 42.84,13.5 v1(41.06,13.5)
